# EAGLE design piezo-preamp-tickler2 (EAGLE 7.5.0)
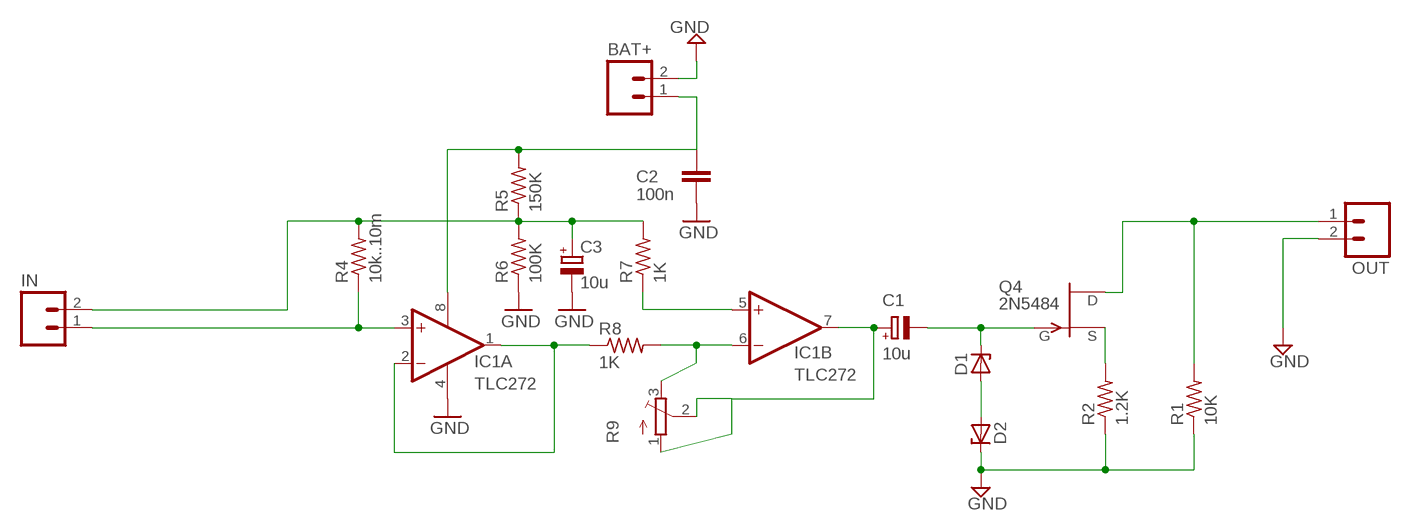
[diagram p0: schematic, sheet 1]

## Parts
BAT+  M02LOCK  [1X02_LOCK]
C1  10u  CPOL-EUE2.5-5  [E2,5-5]
C2  100n  C-EU025-025X050  [C025-025X050]
C3  10u  CPOL-EUE2.5-5  [E2,5-5]
D1  1N821  [DO35Z10]
D2  1N821  [DO35Z10]
IC1  TLC272  TLC272P  [DIL08]
IN  M02LOCK  [1X02_LOCK]
OUT  M02LOCK  [1X02_LOCK]
Q4  2N5484  [TO92-]
R1  10K  R-US_0204/2V  [0204V]
R2  1.2K  R-US_0204/2V  [0204V]
R4  10k..10m  R-US_0204/2V  [0204V]
R5  150K  R-US_0204/2V  [0204V]
R6  100K  R-US_0204/2V  [0204V]
R7  1K  R-US_0204/2V  [0204V]
R8  1K  R-US_0204/2V  [0204V]
R9  TRIMPOT3386  [TRIM-3386]

## Nets
GND: BAT+.2 C2.1 C3.- IC1.4(P:V-) OUT.2 R6.1
N$1: D1.A D2.A
N$2: OUT.1 Q4.3(D) R1.2
N$3: Q4.2(S) R2.2
N$5: IC1.5(B:+IN) R7.1
N$6: C1.+ IC1.7(B:OUT) R9.1(A) R9.2(S)
N$7: IC1.6(B:-IN) R8.2 R9.3(E)
N$8: C3.+ IN.2 R4.2 R5.1 R6.2 R7.2
N$9: IC1.3(A:+IN) IN.1 R4.1
N$10: C1.- D1.C Q4.1(G)
N$14: IC1.1(A:OUT) IC1.2(A:-IN) R8.1
R3: D2.C R1.1 R2.1 ; supply symbol labelled GND
V9V: BAT+.1 C2.2 IC1.8(P:V+) R5.2

## Library data of the parts
BAT+ OUT = CMU-ArtFab:M02: Header 2 Standard 2-pin 0.1" header. Use with straight break away headers (SKU : PRT-00116), right angle break away headers (PRT-00553), swiss pins (PRT-00743), machine pins (PRT-00117), and female headers (PRT-00115). Molex polarized connector foot print use with SKU : PRT-08233 with associated crimp pins and housings.
C1 C3 = rcl:CPOL-EU: POLARIZED CAPACITOR, European symbol
C2 = rcl:C-EU: CAPACITOR, European symbol
D1 D2 = diode:1N821: Reference DIODE temperature compensated, 6,2 V
IC1 = linear:TLC272: OP AMP
IN = SparkFun-Connectors:M02: Header 2 Standard 2-pin 0.1" header. Use with straight break away headers (SKU : PRT-00116), right angle break away headers (PRT-00553), swiss pins (PRT-00743), machine pins (PRT-00117), and female headers (PRT-00115). Molex polarized connector foot print use with SKU : PRT-08233 with associated crimp pins and housings.
Q4 = transistor-fet:?548*: N-Channel JFETs Source: VISHAY 2N5484.pdf Compatible: TO92 2N5245 J304 J305 U310 J308 J309 J310 TO72 2N4416 2N4416A 2N3823 2N4351 3N169 3N170 3N171 MFE3002 TO18 2N3796 2N3797 MFE825 Source: Motorola European Master Guide Pacge 3-59
R1 R2 R4-R8 = resistor:R-US_: RESISTOR, American symbol
R9 = adafruit:TRIMPOT: SMT trimmer potentiometer part number TC33X http://www.ladyada.net/library/eagle

## Net classes
0 default: width 0.6 mm, clearance 0.2 mm

## Board
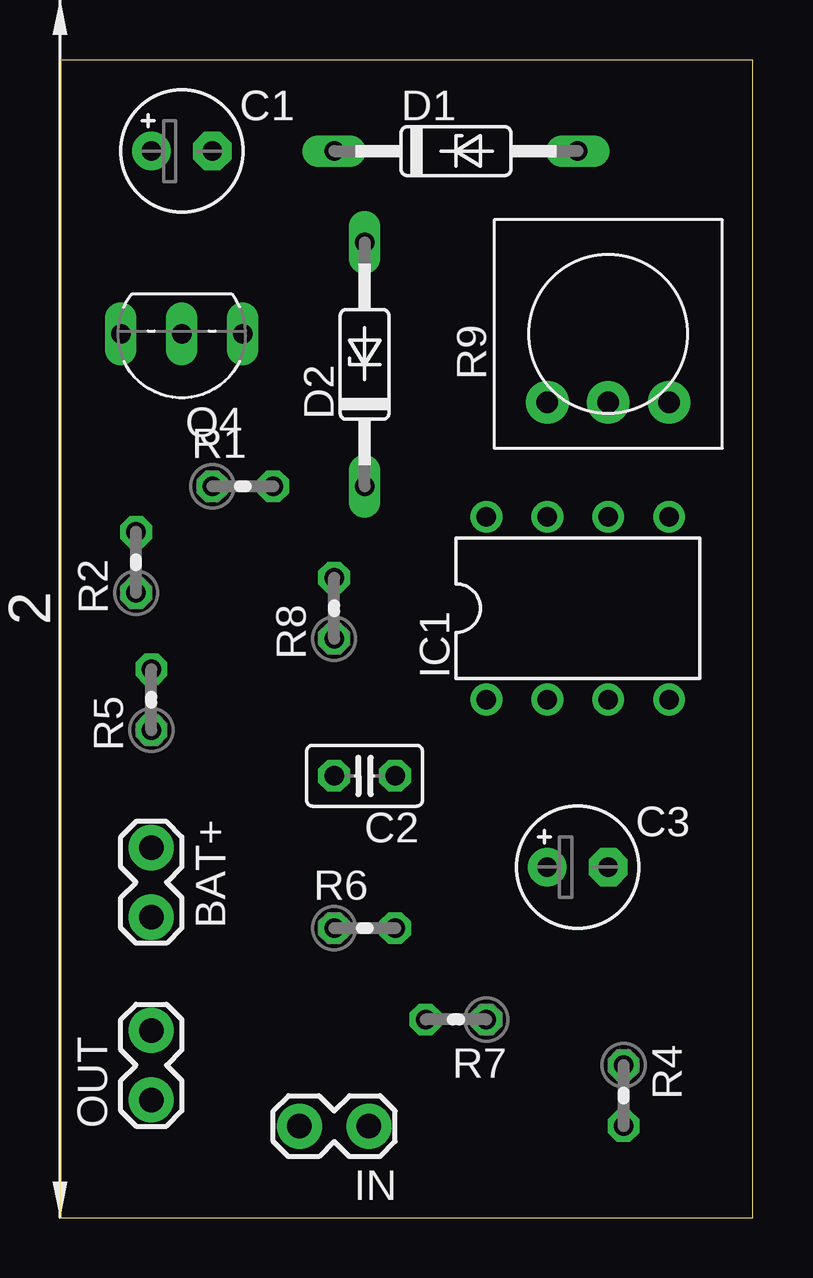
[diagram p1: board, top side]
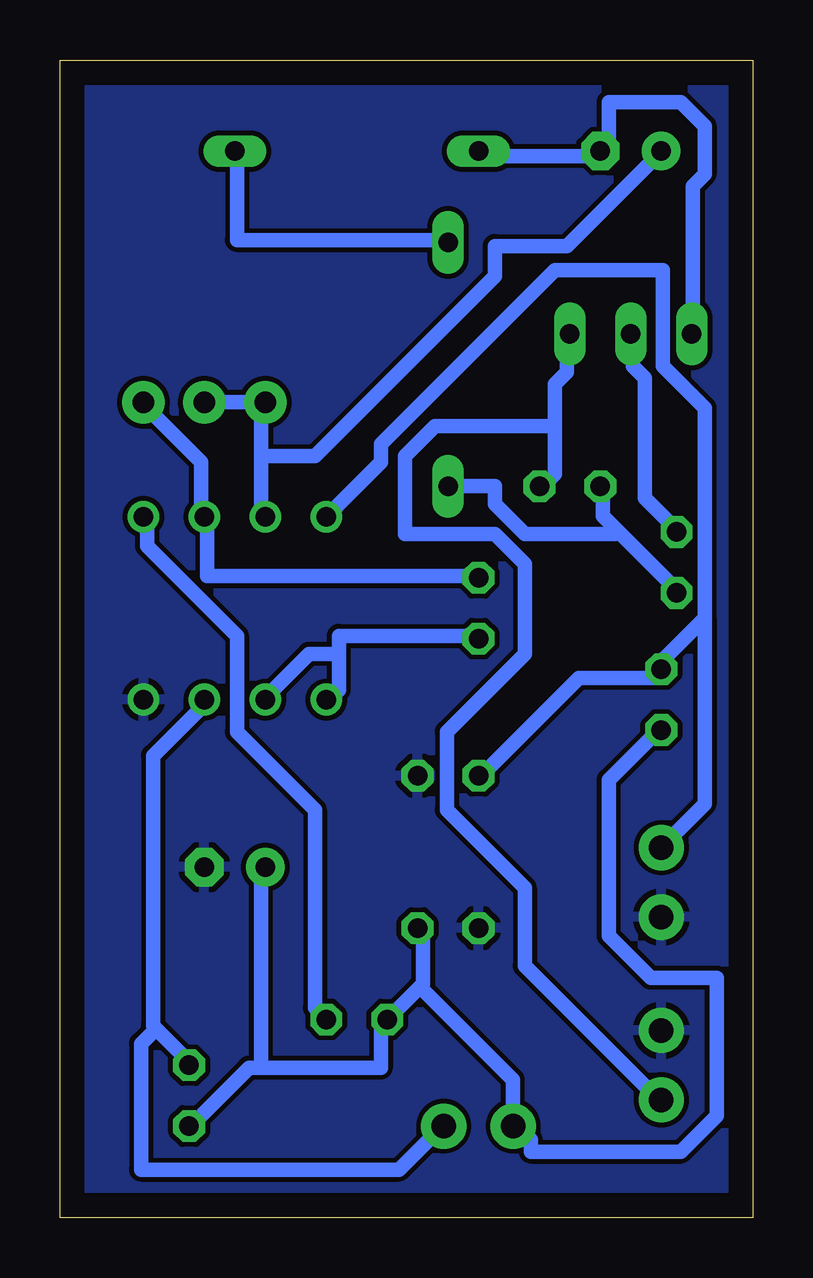
[diagram p2: board, bottom side, seen from below]

Size 28.88 x 48.25 mm. Coordinates in mm from the lower left corner, seen from the top.
Outline: 0,0 28.88,0 28.88,48.25 0,48.25 0,0
Copper layers (1*16): Top 0.035mm / dielectric 1.5mm / Bottom 0.035mm
Design rules "default": minimum track width 10mil, minimum drill 24mil, track to track 8mil, track to pad 8mil, pad to pad 8mil, via to via 8mil, smd to smd 8mil, copper to edge 40mil, drill to drill 8mil, minimum pad ring 10mil, minimum via ring 8mil, stop-mask expansion 4mil, vias tented up to drill 0mil, thermal gap 10mil

### Footprints (pad centres in the part's own frame; a part is rotated, then mirrored left to right if it is on the bottom)
1X02_LOCK = drill 1.016 pad 1.88: 1 -0.178,0; 2 2.718,0
E2,5-5 = drill 0.813 pad 1.6: + -1.27,0 | drill 0.813 pad 1.6 octagon: - 1.27,0
C025-025X050 = drill 0.813 octagon: 1 -1.27,0; 2 1.27,0
DO35Z10 = drill 0.813 long: A 5.08,0; C -5.08,0
DIL08 = drill 0.813 pad 1.27: 1 -3.81,-3.81; 2 -1.27,-3.81; 3 1.27,-3.81; 4 3.81,-3.81; 5 3.81,3.81; 6 1.27,3.81; 7 -1.27,3.81; 8 -3.81,3.81
TO92- = drill 0.813 long: 1 2.54,0; 2 0,0; 3 -2.54,0
0204V = drill 0.813 octagon: 1 -1.27,0; 2 1.27,0
TRIM-3386 = drill 0.9 pad 1.778: 1 -2.54,-2.857; 2 0,-2.857; 3 2.54,-2.857

### Placement (x,y rotation side)
BAT+  3.81,15.24 270 top
C1  5.08,44.45 0 top
C2  12.7,18.41 180 top
C3  21.59,14.61 0 top
D1  16.51,44.45 0 top
D2  12.7,35.56 90 top
IC1  21.59,25.4 0 top
IN  12.7,3.81 180 top
OUT  3.81,5.08 90 top
Q4  5.08,36.83 180 top
R1  7.62,30.48 0 top
R2  3.17,27.3 90 top
R4  23.5,5.08 270 top
R5  3.81,21.59 90 top
R6  12.7,12.06 0 top
R7  16.51,8.26 180 top
R8  11.43,25.4 90 top
R9  22.86,36.83 0 top

### Tracks (layer width: path | path; a pad name or v marks a point on that pad's centre or on a via)
GND
  pour Bottom: 0,48.26 29.21,48.26 29.21,0 0,0
N$1
  Bottom 0.6: D2.A 12.75,40.75 21.5,40.75 21.5,44.25 D1.A
N$2
  Bottom 0.6: 8.25,33 8.25,34.75 7.75,35.25 7.75,36.75 Q4.3 | 8.25,33 8.25,31 8.75,30.5 R1.2 | 8.25,33 13.25,33 14.5,31.75 14.5,28.5 10.75,28.5 9.5,27.25 9.5,23.5 12.75,20.25 12.75,17 9.5,13.75 9.5,10.5 4,5 OUT.1
N$3
  Bottom 0.6: R2.2 3.25,28.75 4.5,30 4.5,35 5,35.5 5,36.75 Q4.2
N$5
  Bottom 0.6: R7.1 18,8.5 18.25,8.75 18.25,17 21.5,20.25 21.5,24.25 25.25,28 25.25,29 IC1.5
N$6
  Bottom 0.6: 20.5,31.75 20.5,33.75 R9.1 20.5,34 22.75,34 R9.2 | 20.5,31.75 20.5,29.25 IC1.7 | 20.5,31.75 18.25,31.75 10.75,39.25 10.75,40.5 7.75,40.5 4,44.25 C1.+
N$7
  Bottom 0.6: R8.2 11.5,26.75 22.75,26.75 22.75,29 IC1.6 23,29.25 23,31.5 25.25,33.75 R9.3
N$8
  Bottom 0.6: 13.88,9.62 13.75,9.75 13.75,12 R6.2 | 13.88,9.62 15,8.5 R7.2 15.5,8.25 15.5,6.25 20.5,6.25 | 20.5,6.25 21,6.25 23.25,4 R4.2 | 20.5,6.25 20.5,14.5 C3.+ | R5.1 4,20.25 6,18.25 6,11.75 4.25,10 1.5,10 1.5,4.25 3,2.75 9.25,2.75 9.25,3.25 9.75,3.75 IN.2 10,4 10,5.75 13.88,9.62
N$9
  Bottom 0.6: 24.88,7.88 25,8 25,19.25 23,21.25 23,21.5 IC1.3 | 24.88,7.88 23.5,6.5 R4.1 | 24.88,7.88 25.5,7.25 25.5,2 14.75,2 13,3.75 IN.1
N$10
  Bottom 0.6: Q4.1 2.5,37 2.5,43 2,43.5 2,45.5 3,46.5 6,46.5 6,44.75 6.25,44.5 C1.- 6.5,44.25 11.25,44.25 D1.C
N$14
  Bottom 0.6: 17.25,23.5 17.25,22 17.75,21.5 IC1.1 | 17.25,23.5 17.25,24.25 11.5,24.25 R8.1 | 17.25,23.5 18.5,23.5 20.25,21.75 IC1.2
R3
  Bottom 0.6: 5.62,28.62 6.25,29.25 6.25,30.25 R1.1 | 5.62,28.62 3.25,26.25 R2.1 | D2.C 12.5,30.5 10.75,30.5 10.75,29.75 9.5,28.5 5.75,28.5 5.62,28.62
V9V
  Bottom 0.6: C2.2 11.25,18.5 7.25,22.5 3.75,22.5 3.75,22.75 R5.2 3.75,23 3.75,23.25 2,25 | 2,25 2,33.75 3.75,35.5 3.75,39.5 8.25,39.5 15.5,32.25 15.5,31.5 17.75,29.25 IC1.8 | 2,25 2,17.25 3.75,15.5 BAT+.1